# EAGLE design BATT_FLEX9 (EAGLE 9.6.2)
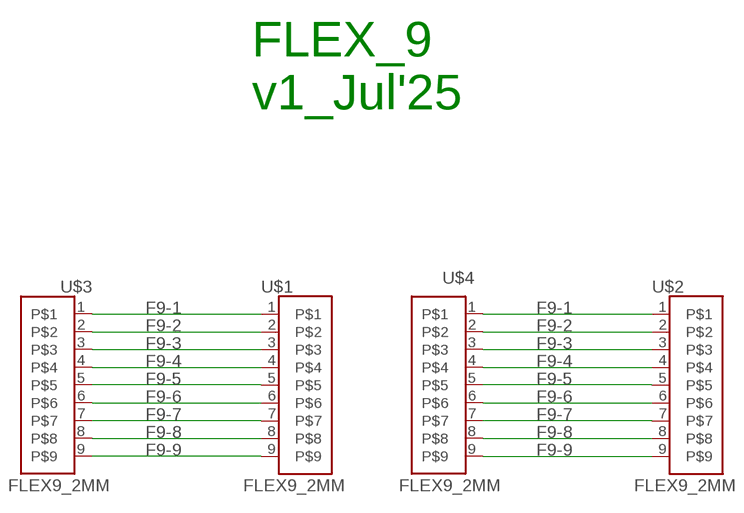
[diagram p0: schematic, sheet 1]

## Parts
U$1  FLEX9_2MM  [FLEX9_2MM]
U$2  FLEX9_2MM  [FLEX9_2MM]
U$3  FLEX9_2MM  [FLEX9_2MM]
U$4  FLEX9_2MM  [FLEX9_2MM]

## Nets
F9-1: U$1.1 U$2.1 U$3.1 U$4.1
F9-2: U$1.2 U$2.2 U$3.2 U$4.2
F9-3: U$1.3 U$2.3 U$3.3 U$4.3
F9-4: U$1.4 U$2.4 U$3.4 U$4.4
F9-5: U$1.5 U$2.5 U$3.5 U$4.5
F9-6: U$1.6 U$2.6 U$3.6 U$4.6
F9-7: U$1.7 U$2.7 U$3.7 U$4.7
F9-8: U$1.8 U$2.8 U$3.8 U$4.8
F9-9: U$1.9 U$2.9 U$3.9 U$4.9

## Notes on the sheet
- FLEX_9
  v1_Jul'25

## Library data of the parts
U$1-U$4 = Flex_3mm:FLEX9_2MM

## Board
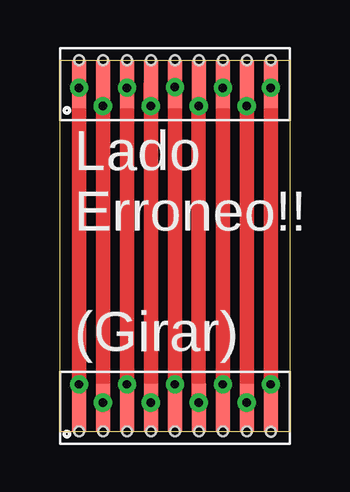
[diagram p1: board, top side]
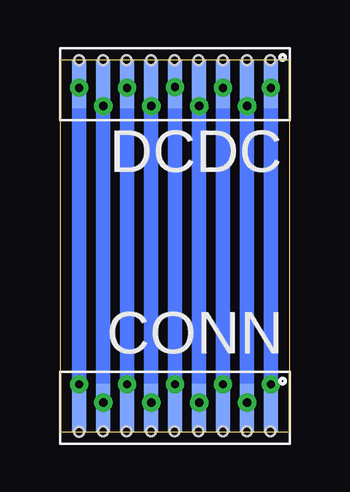
[diagram p2: board, bottom side, seen from below]

Size 9.6 x 15.5 mm. Coordinates in mm from the lower left corner, seen from the top.
Outline: 0,15.5 9.6,15.5 9.6,0 0,0 0,15.5
Copper layers (1*16): Top 0.035mm / dielectric 1.5mm / Bottom 0.035mm
Design rules "default *": minimum track width 6mil, minimum drill 0.35mm, track to track 6mil, track to pad 6mil, pad to pad 6mil, via to via 6mil, smd to smd 6mil, copper to edge 8mil, drill to drill 6mil, minimum pad ring 10mil, minimum via ring 8mil, stop-mask expansion 4mil, vias tented up to drill 50mil, thermal gap 10mil
Holes 0.4 mm at 0.81,0.01 1.8,0.01 2.8,0.01 3.81,0.01 4.81,0.01 5.8,0.01 6.81,0.01 7.8,0.01 0.81,15.5 1.8,15.5 2.8,15.5 3.81,15.5 4.81,15.5 5.8,15.5 6.81,15.5 7.8,15.5 8.8,15.5 8.8,0

### Footprints (pad centres in the part's own frame; a part is rotated, then mirrored left to right if it is on the bottom)
FLEX9_2MM = smd 0.6 x 2: 1 0.8,1.5; 2 1.8,1.5; 3 2.8,1.5; 4 3.8,1.5; 5 4.8,1.5; 6 5.8,1.5; 7 6.8,1.5; 8 7.8,1.5; 9 8.8,1.5

### Placement (x,y rotation side)
U$1  0,13 0 top
U$2  0,16 180 bottom
U$3  0,-0.5 0 top
U$4  0,2.5 180 bottom

### Tracks (layer width: path | path; a pad name or v marks a point on that pad's centre or on a via)
F9-1  (via drill 0.35)
  Top 0.61: v0.8,14.34 U$2.1 v0.8,1.97 U$4.1
  Bottom 0.61: v0.8,14.34 U$2.1 v0.8,1.97 U$4.1
F9-2  (via drill 0.35)
  Top 0.406: v1.8,1.22 v1.79,1.21
  Top 0.61: v1.8,1.22 U$4.2 v1.8,13.57 | v1.8,13.57 v1.79,13.58 | U$2.2 v1.8,13.57
  Bottom 0.61: v1.79,1.21 U$4.2 v1.8,13.57 | v1.8,13.57 v1.79,13.58 | U$2.2 v1.8,13.57
F9-3  (via drill 0.35)
  Top 0.61: v2.8,14.34 U$2.3 v2.8,1.97 U$4.3
  Bottom 0.61: U$2.3 v2.8,1.97 U$4.3
F9-4  (via drill 0.35)
  Top 0.406: v3.8,1.22 v3.79,1.21
  Top 0.61: v3.8,1.22 U$4.4 v3.8,13.57 v3.79,13.58 U$2.4
  Bottom 0.61: v3.79,1.21 U$4.4 v3.8,13.57 v3.79,13.58 U$2.4
F9-5  (via drill 0.35)
  Top 0.61: v4.8,1.97 U$4.5 U$2.5 v4.8,14.37
  Bottom 0.61: U$4.5 v4.8,1.97 U$2.5
F9-6  (via drill 0.35)
  Top 0.406: v5.8,1.22 v5.79,1.21
  Top 0.61: U$2.6 v5.8,13.59 v5.79,13.58 5.79,1.23 v5.8,1.22 U$4.6
  Bottom 0.61: v5.8,13.57 v5.79,13.58 | U$2.6 v5.8,1.22 | v5.8,1.22 v5.79,1.21 | U$4.6 v5.8,1.22
F9-7  (via drill 0.35)
  Top 0.61: v6.8,1.97 U$4.7 v6.8,14.34 U$2.7
  Bottom 0.61: U$4.7 v6.8,1.97 v6.8,14.34 U$2.7
F9-8  (via drill 0.35)
  Top 0.406: v7.8,1.22 v7.79,1.21
  Top 0.61: v7.79,13.58 v7.8,13.59 U$2.8 v7.8,1.22 U$4.8
  Bottom 0.61: v7.79,13.58 v7.8,13.59 U$2.8 v7.8,1.22 | v7.8,1.22 v7.79,1.21 | U$4.8 v7.8,1.22
F9-9  (via drill 0.35)
  Top 0.61: v8.8,1.97 U$3.9 U$1.9
  Bottom 0.61: U$3.9 v8.8,1.97 U$1.9
F11-12  (via drill 0.35)
  other vias: 8.8,14.34

### Text on the board
tNames: Lado / Erroneo!! / / (Girar)
bNames: DCDC | CONN | doblar